# EAGLE design 2030_Switches (EAGLE 7.7.0)
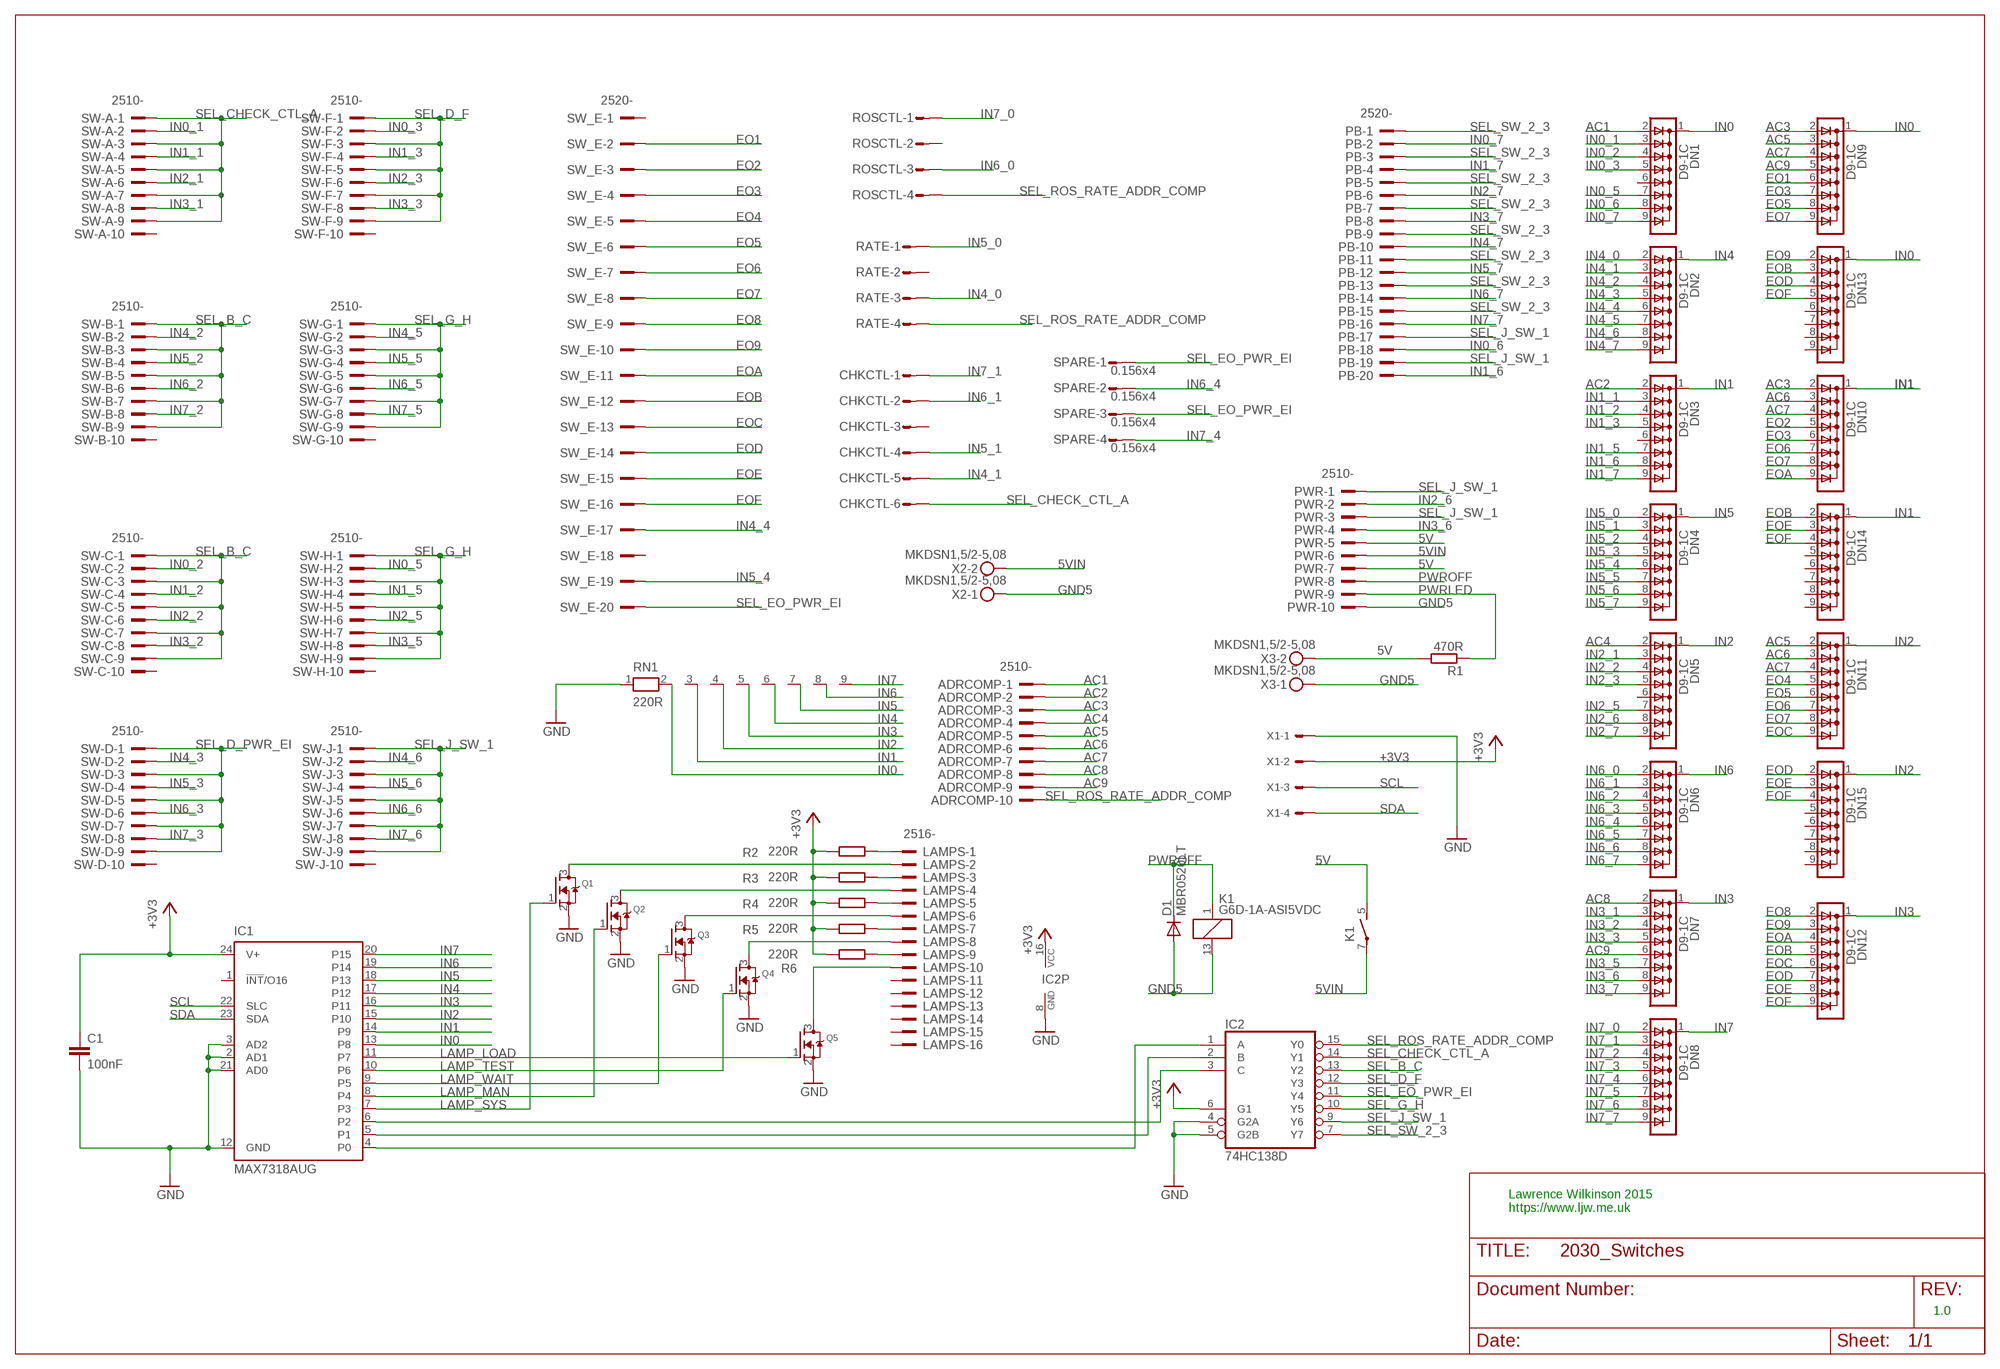
[diagram p0: schematic, sheet 1]

## Parts
ADRCOMP  2510-  [PAK100/2500-10]
C1  100nF  C-EUC1206  [C1206]
CHKCTL  S06P  [S06P]
D1  MBR0520LT  [SOD123]
DN1  D9-1C  [SIL09C]
DN2  D9-1C  [SIL09C]
DN3  D9-1C  [SIL09C]
DN4  D9-1C  [SIL09C]
DN5  D9-1C  [SIL09C]
DN6  D9-1C  [SIL09C]
DN7  D9-1C  [SIL09C]
DN8  D9-1C  [SIL09C]
DN9  D9-1C  [SIL09C]
DN10  D9-1C  [SIL09C]
DN11  D9-1C  [SIL09C]
DN12  D9-1C  [SIL09C]
DN13  D9-1C  [SIL09C]
DN14  D9-1C  [SIL09C]
DN15  D9-1C  [SIL09C]
IC1  MAX7318AUG  MAX7313AEGSOIC  [SO24L]
IC2  74HC138D  [SO16]
K1  G6D-1A-ASI5VDC  [G6D]
LAMPS  2516-  [PAK100/2500-16]
PB  2520-  [PAK100/2500-20]
PWR  2510-  [PAK100/2500-10]
Q1  MOSFET-NREFLOW  [SOT23]
Q2  MOSFET-NREFLOW  [SOT23]
Q3  MOSFET-NREFLOW  [SOT23]
Q4  MOSFET-NREFLOW  [SOT23]
Q5  MOSFET-NREFLOW  [SOT23]
R1  470R  R-EU_M1206  [M1206]
R2  220R  R-EU_R0805  [R0805]
R3  220R  R-EU_R0805  [R0805]
R4  220R  R-EU_R0805  [R0805]
R5  220R  R-EU_R0805  [R0805]
R6  220R  R-EU_R0805  [R0805]
RATE  S04P  [S04P]
RN1  220R  RN08  [RN-9]
ROSCTL  S04P  [S04P]
SPARE  0.156x4  S04P  [S04P]
SW-A  2510-  [PAK100/2500-10]
SW-B  2510-  [PAK100/2500-10]
SW-C  2510-  [PAK100/2500-10]
SW-D  2510-  [PAK100/2500-10]
SW-F  2510-  [PAK100/2500-10]
SW-G  2510-  [PAK100/2500-10]
SW-H  2510-  [PAK100/2500-10]
SW-J  2510-  [PAK100/2500-10]
SW_E  2520-  [PAK100/2500-20]
X1  KK-156-4  [KK-156-4]
X2  MKDSN1,5/2-5,08  [MKDSN1,5/2-5,08]
X3  MKDSN1,5/2-5,08  [MKDSN1,5/2-5,08]

## Nets
5V [power]: K1.5(2:S) PWR.5 PWR.7 R1.2 X3.2
5VIN [power]: K1.7(2:P) PWR.6 X2.2
+3V3 [lowpower]: C1.1 IC1.24(V+) IC2.6(G1) IC2.16(VCC) R2.1 R3.1 R4.1 R5.1 R6.1 X1.2
AC1: ADRCOMP.1 DN1.2
AC2: ADRCOMP.2 DN3.2
AC3: ADRCOMP.3 DN9.2 DN10.2
AC4: ADRCOMP.4 DN5.2
AC5: ADRCOMP.5 DN9.3 DN11.2
AC6: ADRCOMP.6 DN10.3 DN11.3
AC7: ADRCOMP.7 DN9.4 DN10.4 DN11.4
AC8: ADRCOMP.8 DN7.2
AC9: ADRCOMP.9 DN7.6 DN9.5
EO1: DN9.6 SW_E.2
EO2: DN10.5 SW_E.3
EO3: DN9.7 DN10.6 SW_E.4
EO4: DN11.5 SW_E.5
EO5: DN9.8 DN11.6 SW_E.6
EO6: DN10.7 DN11.7 SW_E.7
EO7: DN9.9 DN10.8 DN11.8 SW_E.8
EO8: DN12.2 SW_E.9
EO9: DN12.3 DN13.2 SW_E.10
EOA: DN10.9 DN12.4 SW_E.11
EOB: DN12.5 DN13.3 DN14.2 SW_E.12
EOC: DN11.9 DN12.6 SW_E.13
EOD: DN12.7 DN13.4 DN15.2 SW_E.14
EOE: DN12.8 DN14.3 DN15.3 SW_E.15
EOF: DN12.9 DN13.5 DN14.4 DN15.4 SW_E.16
GND [lowpower]: C1.2 IC1.2(AD1) IC1.3(AD2) IC1.12(GND) IC1.21(AD0) IC2.4(G2A) IC2.5(G2B) IC2.8(GND) Q1.2(S) Q2.2(S) Q3.2(S) Q4.2(S) Q5.2(S) RN1.1 X1.1
GND5 [power]: D1.A K1.13 PWR.10 X2.1 X3.1
IN0: DN1.1(C) DN9.1(C) DN13.1(C) IC1.13(P8) RN1.2
IN0_1: DN1.3 SW-A.2
IN0_2: DN1.4 SW-C.2
IN0_3: DN1.5 SW-F.2
IN0_5: DN1.7 SW-H.2
IN0_6: DN1.8 PB.18
IN0_7: DN1.9 PB.2
IN1: DN3.1(C) DN10.1(C) DN14.1(C) IC1.14(P9) RN1.3
IN1_1: DN3.3 SW-A.4
IN1_2: DN3.4 SW-C.4
IN1_3: DN3.5 SW-F.4
IN1_5: DN3.7 SW-H.4
IN1_6: DN3.8 PB.20
IN1_7: DN3.9 PB.4
IN2: DN5.1(C) DN11.1(C) DN15.1(C) IC1.15(P10) RN1.4
IN2_1: DN5.3 SW-A.6
IN2_2: DN5.4 SW-C.6
IN2_3: DN5.5 SW-F.6
IN2_5: DN5.7 SW-H.6
IN2_6: DN5.8 PWR.2
IN2_7: DN5.9 PB.6
IN3: DN7.1(C) DN12.1(C) IC1.16(P11) RN1.5
IN3_1: DN7.3 SW-A.8
IN3_2: DN7.4 SW-C.8
IN3_3: DN7.5 SW-F.8
IN3_5: DN7.7 SW-H.8
IN3_6: DN7.8 PWR.4
IN3_7: DN7.9 PB.8
IN4: DN2.1(C) IC1.17(P12) RN1.6
IN4_0: DN2.2 RATE.3
IN4_1: CHKCTL.5 DN2.3
IN4_2: DN2.4 SW-B.2
IN4_3: DN2.5 SW-D.2
IN4_4: DN2.6 SW_E.17
IN4_5: DN2.7 SW-G.2
IN4_6: DN2.8 SW-J.2
IN4_7: DN2.9 PB.10
IN5: DN4.1(C) IC1.18(P13) RN1.7
IN5_0: DN4.2 RATE.1
IN5_1: CHKCTL.4 DN4.3
IN5_2: DN4.4 SW-B.4
IN5_3: DN4.5 SW-D.4
IN5_4: DN4.6 SW_E.19
IN5_5: DN4.7 SW-G.4
IN5_6: DN4.8 SW-J.4
IN5_7: DN4.9 PB.12
IN6: DN6.1(C) IC1.19(P14) RN1.8
IN6_0: DN6.2 ROSCTL.3
IN6_1: CHKCTL.2 DN6.3
IN6_2: DN6.4 SW-B.6
IN6_3: DN6.5 SW-D.6
IN6_4: DN6.6 SPARE.2
IN6_5: DN6.7 SW-G.6
IN6_6: DN6.8 SW-J.6
IN6_7: DN6.9 PB.14
IN7: DN8.1(C) IC1.20(P15) RN1.9
IN7_0: DN8.2 ROSCTL.1
IN7_1: CHKCTL.1 DN8.3
IN7_2: DN8.4 SW-B.8
IN7_3: DN8.5 SW-D.8
IN7_4: DN8.6 SPARE.4
IN7_5: DN8.7 SW-G.8
IN7_6: DN8.8 SW-J.8
IN7_7: DN8.9 PB.16
LAMP_LOAD: IC1.11(P7) Q5.1(G)
LAMP_MAN: IC1.8(P4) Q2.1(G)
LAMP_SYS: IC1.7(P3) Q1.1(G)
LAMP_TEST: IC1.10(P6) Q4.1(G)
LAMP_WAIT: IC1.9(P5) Q3.1(G)
N$1: LAMPS.1 R2.2
N$2: LAMPS.3 R3.2
N$3: LAMPS.5 R4.2
N$4: LAMPS.7 R5.2
N$5: LAMPS.9 R6.2
N$7: LAMPS.10 Q5.3(D)
N$8: LAMPS.8 Q4.3(D)
N$9: LAMPS.6 Q3.3(D)
N$10: LAMPS.4 Q2.3(D)
N$11: LAMPS.2 Q1.3(D)
PWRLED: PWR.9 R1.1
PWROFF: D1.C K1.1 PWR.8
SCAN_0: IC1.4(P0) IC2.1(A)
SCAN_1: IC1.5(P1) IC2.2(B)
SCAN_2: IC1.6(P2) IC2.3(C)
SCL: IC1.22(SLC) X1.3
SDA: IC1.23(SDA) X1.4
SEL_B_C: IC2.13(Y2) SW-B.1 SW-B.3 SW-B.5 SW-B.7 SW-B.9 SW-C.1 SW-C.3 SW-C.5 SW-C.7 SW-C.9
SEL_CHECK_CTL_A: CHKCTL.6 IC2.14(Y1) SW-A.1 SW-A.3 SW-A.5 SW-A.7 SW-A.9
SEL_D_F: IC2.12(Y3) SW-F.1 SW-F.3 SW-F.5 SW-F.7 SW-F.9
SEL_D_PWR_EI: SW-D.1 SW-D.3 SW-D.5 SW-D.7 SW-D.9
SEL_EO_PWR_EI: IC2.11(Y4) SPARE.1 SPARE.3 SW_E.20
SEL_G_H: IC2.10(Y5) SW-G.1 SW-G.3 SW-G.5 SW-G.7 SW-G.9 SW-H.1 SW-H.3 SW-H.5 SW-H.7 SW-H.9
SEL_J_SW_1: IC2.9(Y6) PB.17 PB.19 PWR.1 PWR.3 SW-J.1 SW-J.3 SW-J.5 SW-J.7 SW-J.9
SEL_ROS_RATE_ADDR_COMP: ADRCOMP.10 IC2.15(Y0) RATE.4 ROSCTL.4
SEL_SW_2_3: IC2.7(Y7) PB.1 PB.3 PB.5 PB.7 PB.9 PB.11 PB.13 PB.15
Unconnected: CHKCTL.3 DN1.6 DN3.6 DN5.6 DN13.6 DN13.7 DN13.8 DN13.9 DN14.5 DN14.6 DN14.7 DN14.8 DN14.9 DN15.5 DN15.6 DN15.7 DN15.8 DN15.9 IC1.1(!INT!/O16) LAMPS.11 LAMPS.12 LAMPS.13 LAMPS.14 LAMPS.15 LAMPS.16 RATE.2 ROSCTL.2 SW-A.10 SW-B.10 SW-C.10 SW-D.10 SW-F.10 SW-G.10 SW-H.10 SW-J.10 SW_E.1 SW_E.18

## Notes on the sheet
- Lawrence Wilkinson 2015
  https://www.ljw.me.uk
- 1.0

## Library data of the parts
ADRCOMP PWR SW-A SW-B SW-C SW-D SW-F SW-G SW-H SW-J = con-3m:2510-: 3M (TM) Pak 100 4-Wall Header Source: 3M; MF: 3M; MPN: 2510-6002UB; OC_FARNELL: 9838244; OC_NEWARK: 46F4725
C1 = resistor:C-EU: CAPACITOR, European symbol
CHKCTL = con-amp-mt:S06P: AMP MT CONNECTOR; OC_FARNELL: unknown; OC_NEWARK: unknown
D1 = diode:MBR0520LT: SCHOTTKY BARRIER RECTIFIER Source: http://onsemi.com .. MBR0520LT1-D.pdf
DN1-DN15 = diode:D9-1C: 8 DIODES SIL, common cathode
IC1 = maxim:MAX7313AEG: 16-Port I/O Expander with LED Intensity Control, Interrupt, and Hot-Insertion Protection Source: http://datasheets.maxim-ic.com/en/ds/MAX7313.pdf
IC2 = 74xx-eu:74*138: 3-line to 8-line DECODER/DEMULTIPLEXER
K1 = relay:G6D?*: OMRON Slim, Miniature PCB Relay 17.5 × 6.5 × 12.5 mm with Socked Source: http://ecb.omron.com.sg/pdf/relay/power/G6D.pdf; OC_FARNELL: 9812660; OC_NEWARK: unknown
LAMPS = con-3m:2516-: 3M (TM) Pak 100 4-Wall Header Source: 3M; OC_FARNELL: unknown; OC_NEWARK: unknown
PB SW_E = con-3m:2520-: 3M (TM) Pak 100 4-Wall Header Source: 3M; OC_FARNELL: unknown; OC_NEWARK: unknown
Q1-Q5 = adafruit:MOSFET-N: N-Channel Mosfet 2N7002E - 60V 260mA SOT23 [Digikey: 2N7002ET1GOSTR-ND] - REEL BSH103 - 30V 850mA SOT23 [Digikey: 568-5013-1-ND]
R1-R6 = resistor:R-EU_: RESISTOR, European symbol
RATE ROSCTL SPARE = con-amp-mt:S04P: AMP MT CONNECTOR; OC_FARNELL: unknown; OC_NEWARK: unknown
RN1 = resistor-net:RN08: RESISTOR NETWORK; OC_FARNELL: unknown; OC_NEWARK: unknown
X1 = con-molex:KK-156-4: KK 156 HEADER Source: http://www.molex.com/pdm_docs/sd/026604100_sd.pdf; OC_FARNELL: unknown; OC_NEWARK: unknown
X2 X3 = con-phoenix-508:MKDSN1,5/2-5,08: MKDSN 1,5/ 2-5,08 Printklemme Nennstrom: 13,5 A Nennspannung: 250 V Rastermaß: 5,08 mm Polzahl: 2 Anschlussart: Schraubanschluss Montage: Löten Anschlussrichtung Leiter/Platine: 0 ° Artikelnummer: 1729128 Source: http://eshop.phoenixcontact.com .. 1729128.pdf

## Net classes
1 power: width 1.27 mm
2 lowpower: width 0.61 mm

## Board
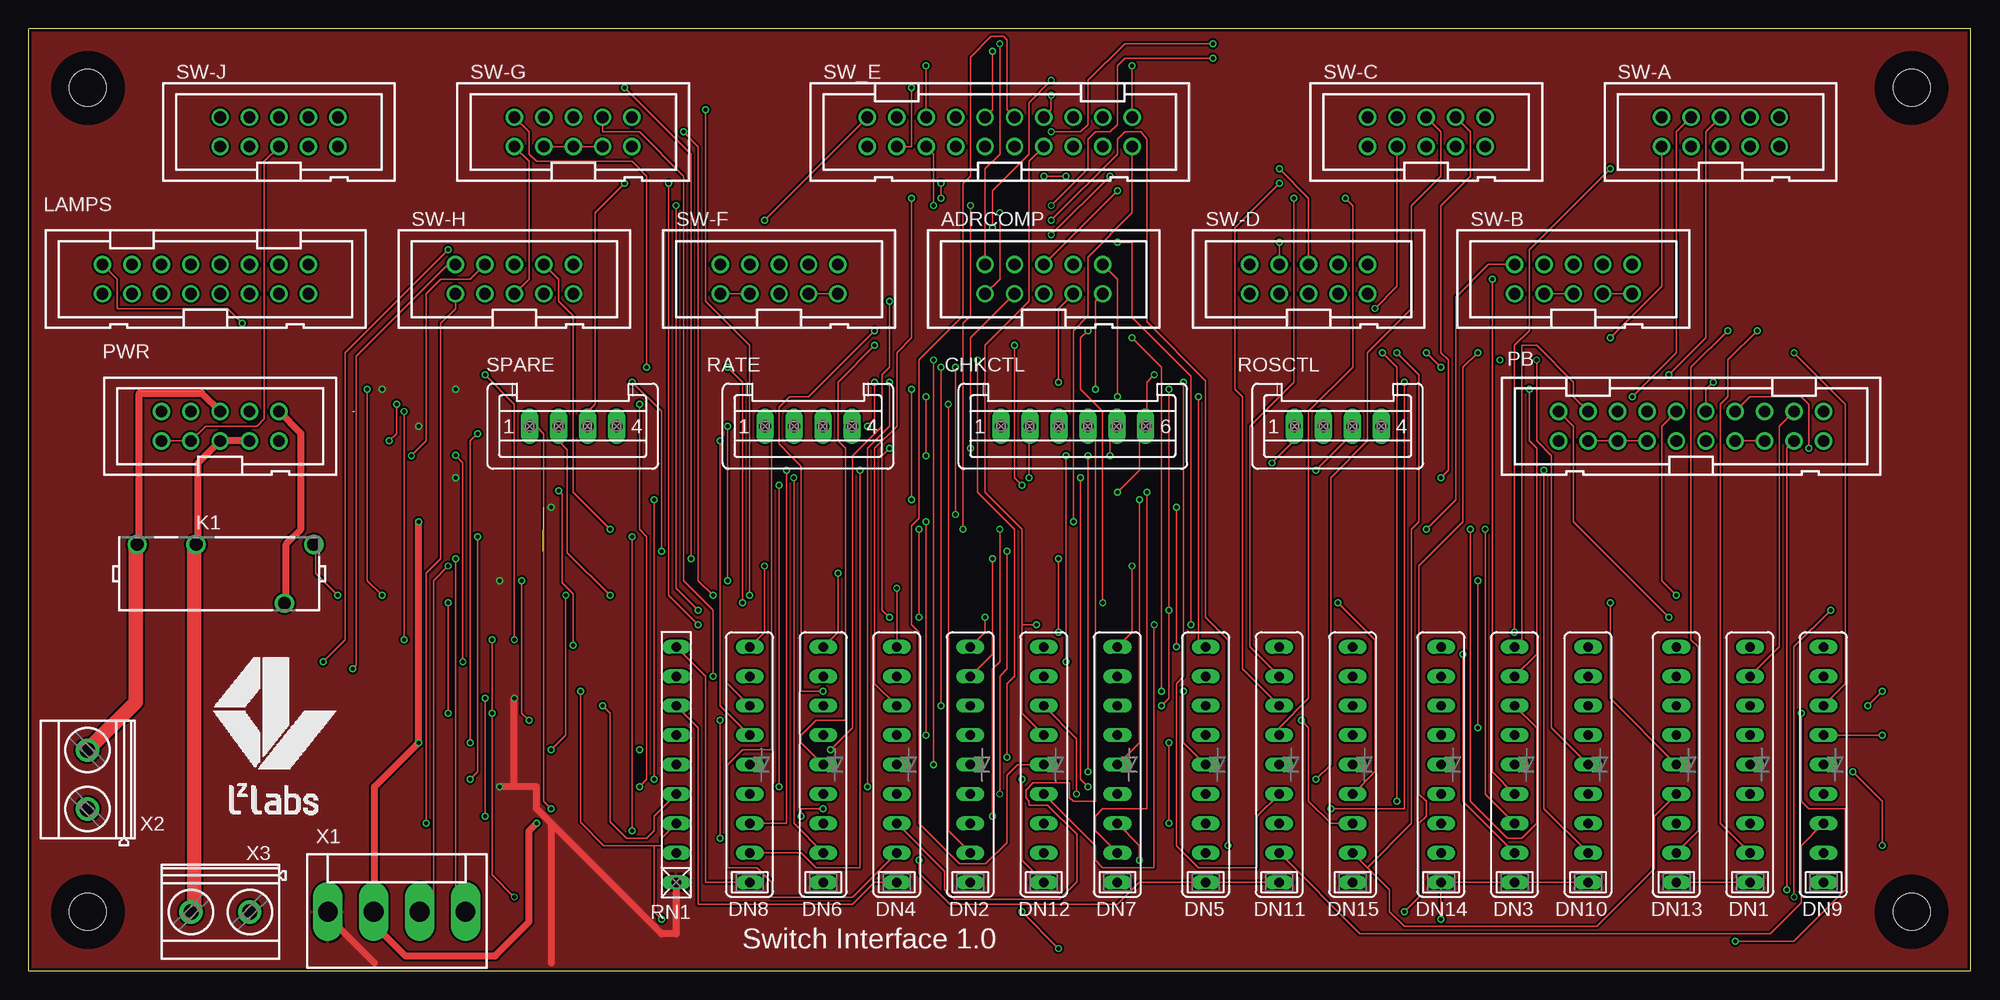
[diagram p1: board, top side]
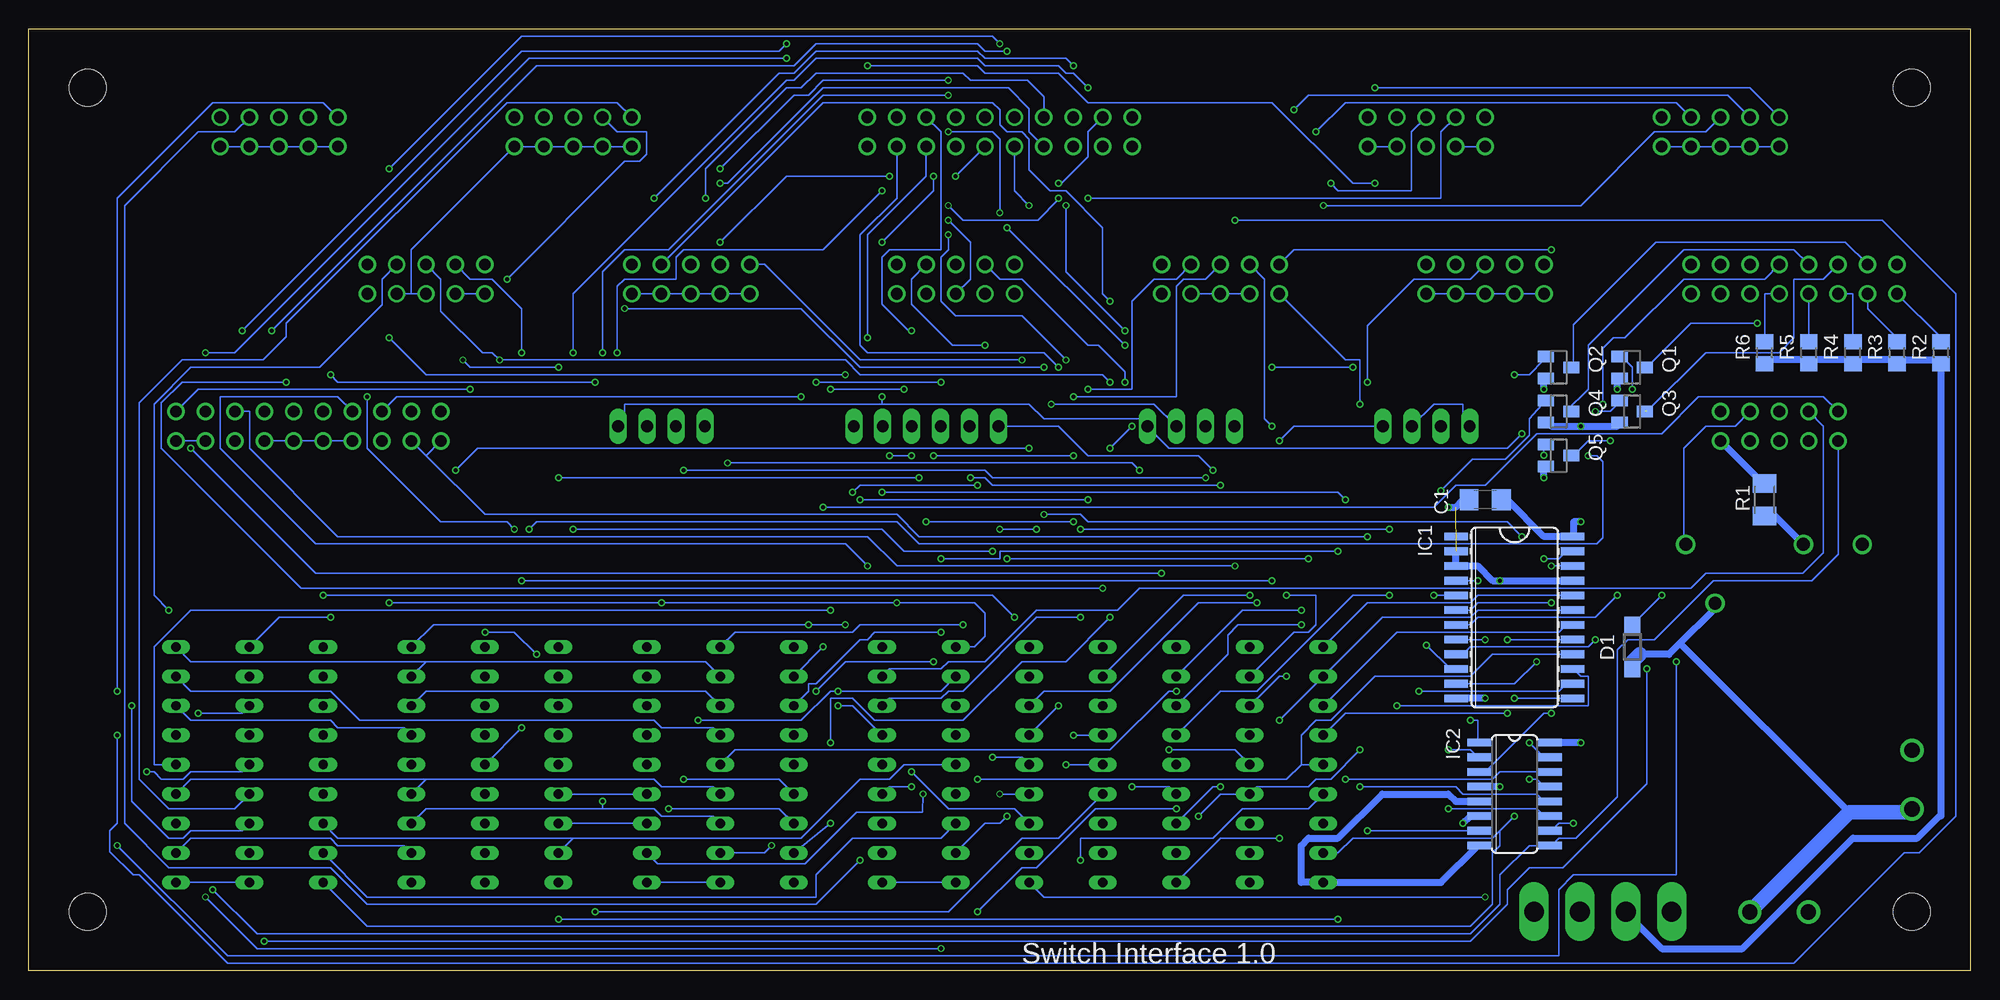
[diagram p2: board, bottom side, seen from below]

Size 167.64 x 81.28 mm. Coordinates in mm from the lower left corner, seen from the top.
Outline: 0,0 167.64,0 167.64,81.28 0,81.28 0,0
Copper layers (1*16): Top 0.018mm / dielectric 1.55mm / Bottom 0.018mm
Design rules "eC_2Layer_PClass6_BaseCopperO18_eCDefault *": minimum track width 0.15mm, minimum drill 0.35mm, track to track 0.17mm, track to pad 0.17mm, pad to pad 0.17mm, via to via 0.17mm, smd to smd 0mil, copper to edge 0.25mm, drill to drill 0.35mm, minimum pad ring 0.175mm, minimum via ring 0.125mm, stop-mask expansion 0mil, vias tented up to drill 0.45mm, thermal gap 0.2mm
Holes 3.17 mm at 5.08,76.2 5.08,5.08 162.56,5.08 162.56,76.2
tRestrict: area 3.5,74.6 to 6.7,77.8; area 3.5,3.5 to 6.7,6.7; area 161,3.5 to 164.1,6.7; area 161,74.6 to 164.1,77.8
bRestrict: area 3.5,74.6 to 6.7,77.8; area 3.5,3.5 to 6.7,6.7; area 161,74.6 to 164.1,77.8; area 161,3.5 to 164.1,6.7

### Footprints (pad centres in the part's own frame; a part is rotated, then mirrored left to right if it is on the bottom)
PAK100/2500-10 = drill 1 pad 1.422: 1 -5.08,-1.27; 2 -5.08,1.27; 3 -2.54,-1.27; 4 -2.54,1.27; 5 0,-1.27; 6 0,1.27; 7 2.54,-1.27; 8 2.54,1.27; 9 5.08,-1.27; 10 5.08,1.27
C1206 = smd 1.6 x 1.8: 1 -1.4,0; 2 1.4,0
S06P = drill 1.016 long: 1 6.25,0; 2 3.75,0; 3 1.25,0; 4 -1.25,0; 5 -3.75,0; 6 -6.25,0
SOD123 = smd 1.4 x 1.4: A 1.9,0; C -1.9,0
SIL09C = drill 0.813 long: 1 -10.16,0; 2 -7.62,0; 3 -5.08,0; 4 -2.54,0; 5 0,0; 6 2.54,0; 7 5.08,0; 8 7.62,0; 9 10.16,0
SO24L = smd 0.66 x 2.032: 1 -6.985,-5.029; 2 -5.715,-5.029; 3 -4.445,-5.029; 4 -3.175,-5.029; 5 -1.905,-5.029; 6 -0.635,-5.029; 7 0.635,-5.029; 8 1.905,-5.029; 9 3.175,-5.029; 10 4.445,-5.029; 11 5.715,-5.029; 12 6.985,-5.029; 13 6.985,5.029; 14 5.715,5.029; 15 4.445,5.029; 16 3.175,5.029; 17 1.905,5.029; 18 0.635,5.029; 19 -0.635,5.029; 20 -1.905,5.029; 21 -3.175,5.029; 22 -4.445,5.029; 23 -5.715,5.029; 24 -6.985,5.029
SO16 = smd 0.66 x 2.032: 1 -4.445,-3.073; 2 -3.175,-3.073; 3 -1.905,-3.073; 4 -0.635,-3.073; 5 0.635,-3.073; 6 1.905,-3.073; 7 3.175,-3.073; 8 4.445,-3.073; 9 4.445,3.073; 10 3.175,3.073; 11 1.905,3.073; 12 0.635,3.073; 13 -0.635,3.073; 14 -1.905,3.073; 15 -3.175,3.073; 16 -4.445,3.073
G6D = drill 1.1 pad 1.676: 1 8.08,2.5; 5 -2.08,2.5; 7 -7.16,2.5; 13 5.54,-2.58
PAK100/2500-16 = drill 1 pad 1.422: 1 -8.89,-1.27; 2 -8.89,1.27; 3 -6.35,-1.27; 4 -6.35,1.27; 5 -3.81,-1.27; 6 -3.81,1.27; 7 -1.27,-1.27; 8 -1.27,1.27; 9 1.27,-1.27; 10 1.27,1.27; 11 3.81,-1.27; 12 3.81,1.27; 13 6.35,-1.27; 14 6.35,1.27; 15 8.89,-1.27; 16 8.89,1.27
PAK100/2500-20 = drill 1 pad 1.422: 1 -11.43,-1.27; 2 -11.43,1.27; 3 -8.89,-1.27; 4 -8.89,1.27; 5 -6.35,-1.27; 6 -6.35,1.27; 7 -3.81,-1.27; 8 -3.81,1.27; 9 -1.27,-1.27; 10 -1.27,1.27; 11 1.27,-1.27; 12 1.27,1.27; 13 3.81,-1.27; 14 3.81,1.27; 15 6.35,-1.27; 16 6.35,1.27; 17 8.89,-1.27; 18 8.89,1.27; 19 11.43,-1.27; 20 11.43,1.27
SOT23 = smd 1 x 1.4: 1 -0.95,-1.1; 2 0.95,-1.1; 3 0,1.1
M1206 = smd 1.6 x 2: 1 -1.4,0; 2 1.4,0
R0805 = smd 1.3 x 1.5: 1 -0.95,0; 2 0.95,0
S04P = drill 1.016 long: 1 3.75,0; 2 1.25,0; 3 -1.25,0; 4 -3.75,0
RN-9 = drill 0.813 long: 1 -10.16,0; 2 -7.62,0; 3 -5.08,0; 4 -2.54,0; 5 0,0; 6 2.54,0; 7 5.08,0; 8 7.62,0; 9 10.16,0
KK-156-4 = drill 1.7 pad 2.184 long: 1 -5.94,0; 2 -1.98,0; 3 1.98,0; 4 5.94,0
MKDSN1,5/2-5,08 = drill 1.3 pad 2: 1 -2.561,0.025; 2 2.519,0.025

### Placement (x,y rotation side)
ADRCOMP  87.63,59.69 0 top
C1  41.91,40.64 180 bottom
CHKCTL  90.17,46.99 180 top
D1  29.21,27.94 270 bottom
DN1  148.59,17.78 90 top
DN2  81.28,17.78 90 top
DN3  128.27,17.78 90 top
DN4  74.93,17.78 90 top
DN5  101.6,17.78 90 top
DN6  68.58,17.78 90 top
DN7  93.98,17.78 90 top
DN8  62.23,17.78 90 top
DN9  154.94,17.78 90 top
DN10  134.62,17.78 90 top
DN11  107.95,17.78 90 top
DN12  87.63,17.78 90 top
DN13  142.24,17.78 90 top
DN14  121.92,17.78 90 top
DN15  114.3,17.78 90 top
IC1  39.37,30.48 270 bottom
IC2  39.37,15.24 270 bottom
K1  16.51,34.29 0 top
LAMPS  15.24,59.69 0 top
PB  143.51,46.99 0 top
PWR  16.51,46.99 0 top
Q1  29.21,52.07 270 bottom
Q2  35.56,52.07 270 bottom
Q3  29.21,48.26 270 bottom
Q4  35.56,48.26 270 bottom
Q5  35.56,44.45 270 bottom
R1  17.78,40.64 270 bottom
R2  2.54,53.34 90 bottom
R3  6.35,53.34 90 bottom
R4  10.16,53.34 90 bottom
R5  13.97,53.34 90 bottom
R6  17.78,53.34 90 bottom
RATE  67.31,46.99 180 top
RN1  55.88,17.78 90 top
ROSCTL  113.03,46.99 180 top
SPARE  46.99,46.99 180 top
SW-A  146.05,72.39 0 top
SW-B  133.35,59.69 0 top
SW-C  120.65,72.39 0 top
SW-D  110.49,59.69 0 top
SW-F  64.77,59.69 0 top
SW-G  46.99,72.39 0 top
SW-H  41.91,59.69 0 top
SW-J  21.59,72.39 0 top
SW_E  83.82,72.39 0 top
X1  31.75,5.08 0 top
X2  5.08,16.51 90 top
X3  16.51,5.08 180 top

### Tracks (layer width: path | path; a pad name or v marks a point on that pad's centre or on a via)
5V
  Top 0.61: PWR.7 PWR.5 14.61,43.81 14.61,36.83
  Top 1.27: 14.61,36.83 K1.5 14.29,36.2 14.29,5.08 X3.2
  Bottom 0.15: R1.2 16.88,39.24
  Bottom 0.61: K1.5 16.88,39.24
5VIN
  Top 0.61: PWR.6 14.92,49.85 9.53,49.85 9.53,36.83
  Top 1.27: 9.53,36.83 K1.7 9.21,36.2 9.21,23.18 5.08,19.05 X2.2
+3V3  (via drill 0.35)
  Top 0.61: 29.84,5.08 29.84,15.88 v33.66,19.68 v33.66,38.73 | v43.84,12.72 43.18,12.06 43.18,4.2 40.26,1.27 32.49,1.27 29.84,3.91 29.84,5.08 | 29.84,5.08 X1.2
  Bottom 0.61: C1.1 40.01,40.64 36.83,37.47 IC1.24 34.29,37.47 34.29,38.73 v33.66,38.73 | v33.66,19.68 IC2.16 | IC2.6 43.18,13.34 v43.84,12.72 | 2.61,13.4 4.58,11.43 10.16,11.43 19.68,1.91 26.67,1.91 29.84,5.08 X1.2 | 2.61,13.4 2.54,13.47 | 6.35,52.7 2.54,52.7 R2.1 2.54,13.34 2.61,13.4 | 6.35,52.7 10.16,52.7 | 6.35,52.7 R3.1 | 10.16,52.7 13.97,52.7 | 10.16,52.7 R4.1 | 13.97,52.7 17.78,52.7 R6.1 | 13.97,52.7 R5.1
AC1  (via drill 0.35)
  Top 0.15: DN1.2 146.05,12.7 146.05,48.9 146.69,49.53 146.69,52.7 v149.22,55.24 | v83.82,65.41 83.82,59.69 ADRCOMP.1 | v102.23,80.01 94.61,80.01 91.44,76.83 91.44,73.03 90.81,72.39 v88.27,72.39
  Bottom 0.15: v88.27,72.39 84.45,72.39 83.82,71.75 v83.82,65.41 | v102.23,80.01 102.87,79.38 125.09,79.38 v149.22,55.24
AC2  (via drill 0.35)
  Top 0.15: DN3.2 123.83,14.61 v123.83,27.3 | ADRCOMP.2 82.55,69.22 83.82,70.48 v83.82,80.01 | v136.53,69.22 129.54,62.23 129.54,55.24 128.27,53.98 v128.27,29.21
  Bottom 0.15: v83.82,80.01 84.45,80.64 125.09,80.64 v136.53,69.22 | v128.27,29.21 125.73,29.21 v123.83,27.3
AC3  (via drill 0.35)
  Top 0.15: v130.81,43.18 130.81,13.97 DN10.2 | ADRCOMP.3 81.28,54.61 v81.28,45.09
  Bottom 0.15: DN10.2 135.25,10.79 140.97,10.79 141.6,11.43 153.67,11.43 DN9.2 | v81.28,45.09 128.91,45.09 v130.81,43.18
AC4  (via drill 0.35)
  Top 0.15: v98.42,19.68 v98.42,12.7 | v74.3,30.48 73.66,31.11 73.66,44.45 v74.3,45.09 | v72.39,46.99 73.03,47.62 v73.03,50.8
  Bottom 0.15: v98.42,12.7 DN5.2 | v98.42,19.68 98.42,23.5 96.52,23.5 94.61,21.59 87,21.59 81.92,26.67 78.11,26.67 v74.3,30.48 | v72.39,46.99 v74.3,45.09 | v73.03,50.8 73.03,51.69 75.31,53.98 76.2,53.98 81.92,59.69 83.82,59.69 ADRCOMP.4
AC5  (via drill 0.35)
  Top 0.15: DN11.2 114.94,3.17 150.34,3.17 153.03,5.87 153.03,10.79 DN9.3 | v88.27,64.77 93.98,70.48 93.98,71.75 94.61,72.39 96,72.39 96.52,71.75 96.52,56 101.6,50.92 101.6,30.48 103.5,28.57 v103.5,10.79
  Bottom 0.15: v103.5,10.79 104.14,10.16 DN11.2 | ADRCOMP.5 86.36,59.69 86.36,62.87 v88.27,64.77
AC6  (via drill 0.35)
  Top 0.15: ADRCOMP.6 88.9,62.23 v93.98,67.31 | v116.84,53.34 118.11,52.07 v118.11,14.61
  Bottom 0.15: DN11.3 108.58,13.34 113.03,13.34 113.67,13.97 118.11,13.97 | 118.11,13.97 133.35,13.97 DN10.3 | v93.98,67.31 99.06,62.23 111.12,62.23 111.76,61.59 111.76,59.69 116.2,59.69 116.84,59.05 v116.84,53.34 | 118.11,13.97 v118.11,14.61
AC7  (via drill 0.35)
  Top 0.15: v99.69,50.8 99.69,25.4 99.06,24.77 99.06,10.79 100.97,8.89 106.05,8.89 106.05,13.34 DN11.4 | ADRCOMP.7 88.9,57.15 v88.9,50.8
  Bottom 0.15: DN11.4 108.58,15.88 113.03,15.88 113.67,16.51 133.35,16.51 | DN10.4 133.35,16.51 | DN9.4 153.67,16.51 133.35,16.51 | v99.69,50.8 v88.9,50.8
AC8  (via drill 0.35)
  Top 0.15: DN7.2 92.08,12.06 92.08,13.34 92.71,13.97 96.52,13.97 v96.52,41.27 | v85.72,41.91 85.09,42.55 v85.09,53.98
  Bottom 0.15: v96.52,41.27 95.89,41.91 v85.72,41.91 | ADRCOMP.8 91.44,59.69 91.44,57.53 87.88,53.98 v85.09,53.98
AC9  (via drill 0.35)
  Top 0.15: v97.79,22.86 98.42,23.5 v98.42,31.11 v98.42,50.16 | ADRCOMP.9 92.08,57.78 v92.08,50.16
  Bottom 0.15: DN7.6 96.52,22.86 v97.79,22.86 | v98.42,31.11 153.67,31.11 156.84,27.94 156.84,17.78 DN9.5 | v98.42,50.16 v92.08,50.16
EO1  (via drill 0.35)
  Top 0.15: v160.02,20.32 DN9.6 | SW_E.2 v63.5,64.77
  Bottom 0.15: v160.02,20.32 160.02,12.7 160.66,12.06 160.66,10.26 158.65,8.26 158.12,8.26 150.5,0.64 15.24,0.64 5.71,10.16 4.45,10.16 1.27,13.34 1.27,58.42 7.62,64.77 v63.5,64.77
EO2  (via drill 0.35)
  Top 0.15: DN10.5 131.44,20.95 131.44,44.45 130.18,45.72 v130.18,52.7 | SW_E.3 76.2,71.12 v76.2,76.2 | v121.92,52.07 v120.65,53.34
  Bottom 0.15: v76.2,76.2 77.47,77.47 78.11,77.47 78.74,78.11 85.09,78.11 85.72,78.74 99.69,78.74 101.6,76.83 102.23,76.83 120.65,58.42 v120.65,53.34 | v121.92,52.07 129.54,52.07 v130.18,52.7
EO3  (via drill 0.35)
  Top 0.15: DN9.7 156.84,24.77 156.84,48.9 v152.4,53.34 | v78.74,66.67 v78.74,67.94 | v88.27,66.04 91.44,69.22 91.44,71.75 92.08,72.39 93.34,72.39 93.98,73.03 93.98,78.11 94.61,78.74 v102.23,78.74
  Bottom 0.15: DN10.6 135.25,20.95 140.97,20.95 141.6,21.59 153.67,21.59 DN9.7 | SW_E.4 76.2,72.39 76.2,70.23 78.49,67.94 v78.74,67.94 | v88.27,66.04 87,64.77 80.54,64.77 78.74,66.57 v78.74,66.67 | v102.23,78.74 124.46,78.74 149.86,53.34 v152.4,53.34
EO4  (via drill 0.35)
  Top 0.15: v68.58,24.13 66.67,24.13 66.67,43.55 65.78,44.45 64.77,45.46 64.77,48.63 65.67,49.53 67.31,49.53 v73.03,55.24 | SW_E.5 78.11,70.48 v78.11,66.04
  Bottom 0.15: DN11.5 106.68,19.05 74.3,19.05 69.22,24.13 v68.58,24.13 | v78.11,66.04 78.11,60.33 v73.03,55.24
EO5  (via drill 0.35)
  Top 0.15: DN11.6 107.95,20.95 110.49,23.5 110.49,48.26 114.3,52.07 114.3,66.04 v113.67,66.67 | v77.47,78.11 SW_E.6
  Bottom 0.15: DN11.6 108.58,20.95 113.03,20.95 113.67,21.59 139.06,21.59 141.6,24.13 153.67,24.13 DN9.8 | v77.47,78.11 78.11,78.74 85.09,78.74 85.72,79.38 99.69,79.38 101.6,77.47 102.87,77.47 v113.67,66.67
EO6  (via drill 0.35)
  Top 0.15: DN11.7 104.78,26.04 104.78,49.53 104.14,50.16 104.14,64.14 v107.95,67.94
  Bottom 0.15: DN11.7 109.22,24.13 133.35,24.13 DN10.7 | SW_E.7 81.28,72.39 81.28,74.4 83.08,76.2 99.06,76.2 107.31,67.94 v107.95,67.94
EO7  (via drill 0.35)
  Top 0.15: DN11.8 105.41,27.94 105.41,46.99 109.22,50.8 v109.22,66.67
  Bottom 0.15: DN11.8 109.22,26.67 133.35,26.67 | DN10.8 133.35,26.67 | DN9.9 153.67,26.67 133.35,26.67 | SW_E.8 80.01,75.42 81.43,76.83 86.36,76.83 87,77.47 99.69,77.47 100.97,76.2 102.23,76.2 109.22,69.22 v109.22,66.67
EO8  (via drill 0.35)
  Top 0.15: v81.28,66.04 81.28,56.52 80.64,55.88 v80.64,38.1 | v83.19,13.34 83.19,26.04 83.82,26.67 v83.82,38.1
  Bottom 0.15: DN12.2 85.09,12.7 83.82,12.7 v83.19,13.34 | v80.64,38.1 v83.82,38.1 | v81.28,66.04 82.55,67.31 SW_E.9
EO9  (via drill 0.35)
  Top 0.15: DN13.2 144.15,12.06 144.15,27.94 143.51,28.57 143.51,52.07 v146.69,55.24 | SW_E.10 83.19,74.3 v83.19,79.38
  Bottom 0.15: DN12.3 88.9,11.43 96.52,11.43 99.69,8.26 99.69,6.35 138.43,6.35 DN13.2 | v83.19,79.38 85.09,79.38 85.72,80.01 99.69,80.01 101.6,78.11 123.83,78.11 v146.69,55.24
EOA  (via drill 0.35)
  Top 0.15: DN12.4 92.08,10.79 92.08,9.53 92.71,8.89 97.16,8.89 v97.16,29.84 | v100.33,29.84 100.33,51.3 95.75,55.88 95.25,56.38 95.25,62.87 v93.98,62.87 | v89.53,68.58 v87.63,68.58
  Bottom 0.15: v97.16,29.84 v100.33,29.84 132.72,29.84 DN10.9 | v87.63,68.58 SW_E.11 | v93.98,62.87 89.53,67.31 v89.53,68.58
EOB
  Top 0.15: SW_E.12 84.45,74.3 84.45,80.33 84.14,80.64 83.08,80.64 81.28,78.85 81.28,68.58 80.64,67.94 80.64,56.52 76.83,52.7 76.83,39.05 76.2,38.42 76.2,29.84 76.83,29.21 76.83,12.7 80.33,9.21 82.61,9.21 84.45,11.05 84.45,16.88 85.35,17.78 DN12.5
  Bottom 0.15: DN12.5 92.08,17.78 93.34,16.51 95.89,16.51 100.97,11.43 120.65,11.43 | DN14.2 120.65,11.43 | DN13.3 140.97,11.43 120.65,11.43
EOC  (via drill 0.35)
  Top 0.15: DN12.6 85.72,22.23 85.72,29.84 | 85.72,29.84 85.72,38.1 82.55,41.27 82.55,53.98 86.36,57.78 86.36,69.85 SW_E.13 | v87,29.84 85.72,29.84
  Bottom 0.15: DN11.9 106.68,29.21 96.52,29.21 95.89,29.84 v87,29.84
EOD  (via drill 0.35)
  Top 0.15: 115.57,8.89 117.47,6.99 117.47,5.08 118.75,3.81 135.38,3.81 140.34,8.77 140.34,13.34 DN13.4 | 115.57,8.89 DN15.2 | SW_E.14 88.27,74.3 v88.27,75.56 | v118.11,53.34 120.02,51.44 120.02,38.73 119.38,38.1 119.38,12.7 115.57,8.89 | DN12.7 90.46,20 v90.46,15.24
  Bottom 0.15: v88.27,75.56 99.06,75.56 112.39,62.23 116.2,62.23 118.11,60.33 v118.11,53.34 | v90.46,15.24 90.49,13.65 96.2,13.65 100.65,9.21 113.35,9.21 DN15.2
EOE  (via drill 0.35)
  Top 0.15: v109.86,21.59 110.49,20.95 110.49,14.61 112.39,12.7 DN15.3 | v97.79,24.13 97.79,52.07 v95.25,54.61
  Bottom 0.15: DN14.3 DN15.3 | DN12.8 88.9,24.13 v97.79,24.13 98.42,24.13 100.97,21.59 v109.86,21.59 | SW_E.15 90.17,68.58 95.25,63.5 v95.25,54.61
EOF  (via drill 0.35)
  Top 0.15: v113.03,31.75 116.2,28.57 116.2,17.14 DN15.4 | DN13.5 136.53,23.5 v136.53,31.75 | v92.71,31.75 92.71,48.26 90.81,50.16 90.81,54.61 v91.44,55.24
  Bottom 0.15: DN12.9 85.99,27.94 85.09,28.84 85.09,30.85 85.99,31.75 v92.71,31.75 v113.03,31.75 v136.53,31.75 | DN15.4 DN14.4 | SW_E.16 88.9,72.39 88.9,62.23 93.34,62.23 93.98,61.59 93.98,57.53 91.69,55.24 v91.44,55.24
GND  (via drill 0.35)  (1 unrouted)
  Top 0.61: 41.91,15.88 43.81,15.88 43.81,13.97 45.09,12.7 | 41.91,15.88 v40.64,15.88 | 45.09,12.7 54.61,3.17 55.88,3.17 RN1.1 | 41.91,15.88 v41.91,23.5 | 29.84,0.64 26.04,4.45 X1.1 | 45.09,12.7 45.09,0.64
  Bottom 0.61: IC1.21 v40.64,33.66 41.27,33.66 42.55,34.92 IC1.3 44.45,34.92 44.45,36.2 IC1.2 | 43.18,40.64 C1.2 43.81,40.64 44.45,40.01 v45.09,40.01 | IC2.8 42.55,10.79 45.72,7.62 RN1.1 57.78,7.62 57.78,10.79 57.15,11.43 54.61,11.43 50.8,15.24 45.09,15.24 44.45,14.61 IC2.5 | v40.64,15.88 IC2.4 | v41.91,23.5 IC1.12 | Q3.2 30.48,46.99 v33.66,46.99 36.2,46.99 Q4.2 | v36.83,42.55 36.83,43.18 Q5.2 | v30.48,50.19 30.48,50.8 Q1.2 | v36.83,50.19 36.83,50.8 Q2.2
  cutout Bottom: 0,81.28 167.64,81.28 167.64,0 0,0
  pour Top: 0,81.28 167.64,81.28 167.64,0 0,0
GND5
  Top 0.61: PWR.10 23.5,46.35 23.5,38.1 22.23,36.83 22.23,31.75 K1.13
  Bottom 0.61: 28.57,27.3 26.04,27.3 25.08,28.26 | 25.08,28.26 22.23,31.11 K1.13 | 25.08,28.26 10.48,13.65
  Bottom 1.27: X3.1 19.05,5.08 10.48,13.65 5.08,13.65 X2.1 | 28.57,27.3 29.21,26.67 D1.A
IN0  (via drill 0.35)
  Top 0.15: DN1.1 DN13.1 | v39.37,13.34 v39.37,23.5
  Bottom 0.15: DN1.1 DN9.1 | v39.37,23.5 IC1.13 | 40.64,12.06 41.27,11.43 53.34,11.43 54.61,10.16 RN1.2 | 40.64,12.06 v39.37,13.34 | DN13.1 138.43,3.81 43.18,3.81 41.27,5.71 41.27,10.16 40.64,10.79 40.64,12.06
IN0_1  (via drill 0.35)
  Top 0.15: v158.75,22.86 v160.02,24.13
  Bottom 0.15: DN1.3 149.22,12.06 153.67,12.06 154.31,11.43 155.57,11.43 158.75,14.61 v158.75,22.86 | SW-A.2 142.24,74.93 151.76,74.93 160.02,66.67 v160.02,24.13
IN0_2
  Bottom 0.15: DN1.4 149.86,13.97 155.57,13.97 158.12,16.51 158.12,49 154.41,52.7 147.42,52.7 145.41,54.71 145.41,55.88 126.36,74.93 116.84,74.93 SW-C.2
IN0_3  (via drill 0.35)
  Top 0.15: v36.2,62.23 27.3,53.34 27.3,28.57 v25.4,26.67 | v160.02,10.79 160.02,14.61 v157.48,17.14
  Bottom 0.15: DN1.5 149.22,17.14 153.67,17.14 154.31,16.51 156.21,16.51 156.84,17.14 v157.48,17.14 | SW-F.2 58.42,62.23 v36.2,62.23 | v25.4,26.67 25.4,8.26 34.29,8.26 35.56,6.99 35.56,1.27 150.5,1.27 v160.02,10.79
IN0_5  (via drill 0.35)
  Top 0.15: v153.03,22.23 153.03,14.61 153.67,13.97 156.84,13.97 156.84,6.99 152.4,2.54 v147.32,2.54 | v27.94,26.04 28.27,26.36 28.27,53.03 36.2,60.96 SW-H.2
  Bottom 0.15: DN1.7 149.22,22.23 v153.03,22.23 | v147.32,2.54 43.18,2.54 40.01,5.71 40.01,6.99 38.1,8.89 35.18,8.89 27.94,16.13 v27.94,26.04
IN0_6
  Top 0.15: DN1.8 151.13,27.94 151.13,46.99 PB.18
IN0_7  (via drill 0.35)
  Top 0.15: v141.6,30.48 133.35,38.73 133.35,46.99 PB.2
  Bottom 0.15: DN1.9 146.05,30.48 v141.6,30.48
IN1  (via drill 0.35)
  Top 0.15: DN10.1 DN3.1 DN14.1 v121.92,4.45 | 53.98,10.79 49.63,10.79 47.62,12.8 v47.62,24.13 | 53.98,10.79 54.61,10.79 54.61,11.43 RN1.3 | v54.61,4.45 53.98,5.08 53.98,10.79
  Bottom 0.15: v47.62,24.13 35.56,24.13 34.92,24.77 IC1.14 | v54.61,4.45 v121.92,4.45
IN1_1  (via drill 0.35)
  Top 0.15: DN3.3 125.73,15.24 v125.73,38.1 | v138.43,49.53 142.24,53.34 142.24,72.39 SW-A.4
  Bottom 0.15: v125.73,38.1 126.36,38.73 132.08,38.73 138.43,45.09 v138.43,49.53
IN1_2  (via drill 0.35)
  Top 0.15: DN3.4 126.36,17.14 v126.36,59.69
  Bottom 0.15: v126.36,59.69 116.2,69.85 114.94,69.85 114.3,70.48 114.3,72.39 116.84,72.39 SW-C.4
IN1_3  (via drill 0.35)
  Top 0.15: v125.09,33.66 v125.09,20.95 | v60.33,33.66 v60.33,46.99
  Bottom 0.15: v125.09,20.95 DN3.5 | v60.33,33.66 v125.09,33.66 | SW-F.4 60.96,59.69 60.96,47.62 v60.33,46.99
IN1_5  (via drill 0.35)
  Top 0.15: DN3.7 130.18,20.95 130.18,12.7 128.91,11.43 127.64,11.43 124.46,14.61 v124.46,38.1 | SW-H.4 38.1,59.69 35.56,59.69 34.29,58.42 34.29,45.72 v33.02,44.45
  Bottom 0.15: v124.46,38.1 123.83,38.73 92.71,38.73 90.81,36.83 32.28,36.83 31.75,37.36 31.75,43.92 32.28,44.45 v33.02,44.45
IN1_6  (via drill 0.35)
  Top 0.15: DN3.8 130.18,27.3 130.18,45.09 129.54,45.72 v129.54,50.16
  Bottom 0.15: v129.54,50.16 153.03,50.16 PB.20
IN1_7
  Top 0.15: DN3.9 128.91,28.57 128.91,53.98 130.18,53.98 133.35,50.8 133.35,49.53 PB.4
IN2  (via drill 0.35)
  Top 0.15: DN11.1 DN5.1 95.89,7.62 93.98,5.71 79.53,5.71 76.83,8.41 v76.83,9.53 | v49.53,22.86 50.16,22.23 50.16,12.85 51.59,11.43 53.34,11.43 53.98,12.06 53.98,13.34 RN1.4
  Bottom 0.15: DN11.1 DN15.1 | v49.53,22.86 33.02,22.86 33.02,25.4 33.66,25.4 34.29,26.04 IC1.15 | v76.83,9.53 76.83,11.43 65.41,11.43 62.87,13.97 57.15,13.97 RN1.4
IN2_1  (via drill 0.35)
  Top 0.15: v112.39,13.97 118.75,13.97 v118.75,50.8 | SW-A.6 144.78,72.39 144.78,54.61 v141.6,51.44
  Bottom 0.15: DN5.3 102.87,13.97 v112.39,13.97 | v141.6,51.44 140.97,50.8 v118.75,50.8
IN2_2  (via drill 0.35)
  Top 0.15: v111.12,16.51 112.39,17.78 112.39,42.55 115.57,45.72 115.57,53.34 119.38,57.15 119.38,66.04 121.92,68.58 121.92,72.39 SW-C.6
  Bottom 0.15: DN5.4 102.87,16.51 v111.12,16.51
IN2_3  (via drill 0.35)
  Top 0.15: DN5.5 99.69,19.68 v99.69,24.13 | v89.53,44.45 v89.53,26.67 | v77.47,44.45 v77.47,49.53
  Bottom 0.15: v99.69,24.13 97.16,26.67 v89.53,26.67 | v77.47,44.45 v89.53,44.45 | SW-F.6 66.04,59.69 67.94,59.69 68.58,59.05 68.58,49.53 v77.47,49.53
IN2_5  (via drill 0.35)
  Top 0.15: v88.9,35.56 v88.9,29.21 | v54.61,36.2 54.61,48.26 v52.07,50.8
  Bottom 0.15: DN5.7 100.33,24.13 100.33,24.77 99.69,24.77 95.89,28.57 95.25,28.57 94.61,29.21 v88.9,29.21 | v88.9,35.56 83.82,35.56 83.82,36.2 v54.61,36.2 | v52.07,50.8 52.07,55.67 48.05,59.69 43.18,59.69 SW-H.6
IN2_6  (via drill 0.35)
  Top 0.15: v99.06,40.01 v99.06,27.94
  Bottom 0.15: v99.06,27.94 DN5.8 | PWR.2 12.7,49.53 23.5,49.53 26.67,46.35 37.47,46.35 41.91,41.91 44.45,41.91 46.35,40.01 v99.06,40.01
IN2_7  (via drill 0.35)
  Top 0.15: DN5.9 100.97,28.57 v100.97,49.53
  Bottom 0.15: v100.97,49.53 135.89,49.53 PB.6
IN3  (via drill 0.35)
  Top 0.15: DN12.1 85.72,9.53 v85.72,16.51
  Bottom 0.15: DN7.1 DN12.1 | IC1.16 41.27,27.3 43.18,25.4 51.44,25.4 55.24,21.59 56.52,21.59 57.78,20.32 57.78,17.78 | RN1.5 57.78,17.78 | 57.78,17.78 59.05,16.51 v85.72,16.51
IN3_1  (via drill 0.35)
  Top 0.15: DN7.3 95.89,10.79 v95.89,9.53
  Bottom 0.15: v95.89,9.53 99.69,5.71 138.43,5.71 141.6,8.89 155.57,8.89 159.38,12.7 159.38,66.04 153.03,72.39 149.86,72.39 SW-A.8
IN3_2  (via drill 0.35)
  Top 0.15: v91.44,15.88 90.81,16.51 v90.81,42.55 | SW-C.8 124.46,72.39 124.46,68.58 121.92,66.04 121.92,53.34 122.56,52.7 122.56,43.18 v121.92,42.55
  Bottom 0.15: DN7.4 93.34,15.88 v91.44,15.88 | v121.92,42.55 v90.81,42.55
IN3_3  (via drill 0.35)
  Top 0.15: DN7.5 95.89,19.68 v95.89,40.64 | v76.2,40.64 v76.2,50.16
  Bottom 0.15: v76.2,40.64 v95.89,40.64 | SW-F.8 68.58,59.69 70.48,59.69 72.39,57.78 72.39,50.16 v76.2,50.16
IN3_5  (via drill 0.35)
  Top 0.15: v76.83,38.1 v76.83,30.48 | v50.16,38.1 46.99,41.27 46.99,56.52 45.72,57.78 45.72,59.69 SW-H.8
  Bottom 0.15: DN7.7 93.34,23.5 88.9,23.5 88.27,24.13 87,24.13 80.64,30.48 v76.83,30.48 | v50.16,38.1 v76.83,38.1
IN3_6
  Bottom 0.15: DN7.8 93.34,26.04 88.9,26.04 88.27,26.67 85.09,26.67 80.64,31.11 73.66,31.11 71.75,33.02 24.13,33.02 22.86,34.29 14.5,34.29 12.7,36.09 12.7,46.99 PWR.4
IN3_7  (via drill 0.35)
  Top 0.15: DN7.9 95.25,29.21 v95.25,34.92
  Bottom 0.15: v95.25,34.92 97.16,36.83 142.88,36.83 151.13,45.09 151.13,49.53 140.97,49.53 PB.8
IN4  (via drill 0.35)
  Top 0.15: v40.01,28.57 v40.01,22.23 40.01,8.26 v41.91,6.35
  Bottom 0.15: v40.01,28.57 IC1.17 | v40.01,22.23 53.98,22.23 RN1.6 | DN2.1 80.01,6.35 v41.91,6.35
IN4_0  (via drill 0.35)
  Top 0.15: DN2.2 79.38,12.06 v79.38,48.9
  Bottom 0.15: v79.38,48.9 70.48,48.9 68.58,46.99 RATE.3
IN4_1  (via drill 0.35)
  Top 0.15: v91.44,44.45 v91.44,17.14 | v93.34,44.45 93.34,46.99 CHKCTL.5
  Bottom 0.15: DN2.3 82.55,13.97 88.27,13.97 v91.44,17.14 | v93.34,44.45 v91.44,44.45
IN4_2  (via drill 0.35)
  Top 0.15: v120.65,38.1 123.19,40.64 123.19,58.12 126.03,60.96 SW-B.2 | v83.82,15.24 83.82,25.4 84.45,26.04 v84.45,36.2
  Bottom 0.15: v84.45,36.2 92.08,36.2 93.98,38.1 v120.65,38.1 | DN2.4 v83.82,15.24
IN4_3  (via drill 0.35)
  Top 0.15: v84.45,18.41 84.45,24.77 85.09,25.4 85.09,38.1 81.92,41.27 v81.92,52.7
  Bottom 0.15: DN2.5 81.92,18.41 v84.45,18.41 | SW-D.2 104.14,60.96 95.89,52.7 v81.92,52.7
IN4_4  (via drill 0.35)
  Top 0.15: v78.74,52.07 v78.74,22.86
  Bottom 0.15: v78.74,22.86 DN2.6 | v78.74,52.07 80.01,53.34 95.25,53.34 95.89,53.98 95.89,63.5 92.71,66.67 SW_E.17
IN4_5  (via drill 0.35)
  Top 0.15: v60.33,52.07 61.59,50.8 v61.59,31.75 | v53.34,52.07 53.34,68.58 52.07,69.85 43.81,69.85 43.18,70.48 43.18,72.39 SW-G.2
  Bottom 0.15: DN2.7 80.01,24.13 74.3,24.13 66.67,31.75 v61.59,31.75 | v53.34,52.07 v60.33,52.07
IN4_6  (via drill 0.35)
  Top 0.15: DN2.8 83.19,27.3 v83.19,35.56 | v57.15,35.56 57.15,70.48 v51.44,76.2
  Bottom 0.15: v57.15,35.56 v83.19,35.56 | v51.44,76.2 19.05,76.2 SW-J.2
IN4_7  (via drill 0.35)
  Top 0.15: DN2.9 82.55,29.21 v82.55,30.48 | v142.24,32.38 140.97,33.66 140.97,46.99 PB.10
  Bottom 0.15: v82.55,30.48 84.45,32.38 v142.24,32.38
IN5
  Top 0.15: DN4.1 73.03,7.62 71.12,5.71 57.78,5.71 57.78,20.95 RN1.7
  Bottom 0.15: RN1.7 49.53,29.21 35.56,29.21 34.92,29.84 IC1.18
IN5_0
  Top 0.15: DN4.2 71.12,6.35 64.14,6.35 64.14,7.62 62.87,8.89 60.33,8.89 60.33,17.78 61.59,19.05 64.14,19.05 64.14,46.99 RATE.1
IN5_1
  Top 0.15: DN4.3 79.06,8.57 79.06,7.04 79.94,6.16 89,6.16 90.49,7.65 90.49,11.75 87.95,14.29 86.36,14.29 86.36,14.61 86.07,14.9 86.07,15.58 86.68,16.19 89.85,16.19 89.85,14.92 90.17,14.61 92.08,14.61 92.08,46.35 91.44,46.99 CHKCTL.4
IN5_2  (via drill 0.35)
  Top 0.15: v118.75,5.08 120.02,6.35 120.02,12.7 120.65,13.34 120.65,14.61 120.02,15.24 120.02,34.92 123.83,38.73 123.83,52.07 v125.09,53.34
  Bottom 0.15: DN4.4 78.74,11.43 81.92,11.43 88.27,5.08 v118.75,5.08 | SW-B.4 129.54,59.69 127.64,59.69 125.09,57.15 v125.09,53.34
IN5_3  (via drill 0.35)
  Top 0.15: v78.11,52.7 v78.11,17.78 | v107.95,62.87 SW-D.4 | v88.27,63.5 v93.34,68.58
  Bottom 0.15: v78.11,17.78 DN4.5 | v107.95,62.87 102.23,68.58 v93.34,68.58 | v88.27,63.5 88.27,62.23 88.9,61.59 88.9,57.78 87.63,56.52 81.92,56.52 v78.11,52.7
IN5_4  (via drill 0.35)
  Top 0.15: v77.47,38.73 v77.47,20.32 | SW_E.19 95.25,65.41 91.44,61.59 91.44,56.52 90.17,55.24 v90.17,38.73
  Bottom 0.15: v77.47,20.32 DN4.6 | v77.47,38.73 v90.17,38.73
IN5_5  (via drill 0.35)
  Top 0.15: DN4.7 73.03,24.77 73.03,45.09 74.93,46.99 74.93,53.34 76.2,54.61 v76.2,66.67
  Bottom 0.15: SW-G.4 45.72,72.39 45.72,66.67 v76.2,66.67
IN5_6  (via drill 0.35)
  Top 0.15: v62.23,32.38 62.23,53.98 58.42,57.78 v58.42,74.3
  Bottom 0.15: DN4.8 67.94,32.38 v62.23,32.38 | v58.42,74.3 57.15,75.56 20.95,75.56 SW-J.4
IN5_7  (via drill 0.35)
  Top 0.15: v74.93,33.02 DN4.9 | v145.41,50.8 144.78,50.16 PB.12
  Bottom 0.15: v74.93,33.02 144.15,33.02 156.21,45.09 156.21,49 154.41,50.8 v145.41,50.8
IN6  (via drill 0.35)
  Top 0.15: v59.69,21.59 v59.69,11.43
  Bottom 0.15: IC1.19 42.55,31.11 43.18,30.48 50.8,30.48 RN1.8 v59.69,21.59 | DN6.1 64.77,11.43 v59.69,11.43
IN6_0  (via drill 0.35)
  Top 0.15: DN6.2 66.04,12.7 v66.04,42.55 | v111.12,43.18 113.67,45.72 113.67,46.99 ROSCTL.3
  Bottom 0.15: v111.12,43.18 85.09,43.18 84.45,42.55 v66.04,42.55
IN6_1  (via drill 0.35)
  Top 0.15: v64.77,41.91 v64.77,15.88 | v86.36,42.55 86.36,46.99 CHKCTL.2
  Bottom 0.15: DN6.3 65.41,15.88 v64.77,15.88 | v64.77,41.91 84.45,41.91 85.09,42.55 v86.36,42.55
IN6_2  (via drill 0.35)
  Top 0.15: v72.39,15.88 72.39,45.09 74.3,46.99 v74.3,50.8
  Bottom 0.15: DN6.4 69.22,15.88 v72.39,15.88 | v74.3,50.8 74.93,51.44 95.89,51.44 97.16,52.7 v127,52.7 127.64,53.34 128.49,53.34 132.08,56.93 132.08,59.69 SW-B.6
IN6_3  (via drill 0.35)
  Top 0.15: DN6.5 66.67,19.68 66.67,20.32 67.94,21.59 70.48,21.59 70.48,45.09 69.85,45.72 69.85,50.8 v73.03,53.98 | SW-D.6 110.49,66.67 v107.95,69.22 | v88.27,76.83 86.36,74.93 86.36,70.48 83.19,67.31 v83.19,64.14
  Bottom 0.15: v107.95,69.22 101.6,75.56 100.33,75.56 99.06,76.83 v88.27,76.83 | v73.03,53.98 v83.19,64.14
IN6_4  (via drill 0.35)
  Top 0.15: v50.16,32.38 46.48,36.07 46.48,44.96 45.72,45.72 45.72,46.99 SPARE.2 46.35,46.99
  Bottom 0.15: DN6.6 64.77,24.13 61.59,24.13 53.34,32.38 v50.16,32.38
IN6_5  (via drill 0.35)
  Top 0.15: v57.78,29.84 55.24,32.38 v55.24,67.94
  Bottom 0.15: DN6.7 64.14,27.3 64.14,28.95 63.24,29.84 v57.78,29.84 | SW-G.6 48.26,72.39 48.26,67.31 54.61,67.31 v55.24,67.94
IN6_6  (via drill 0.35)
  Top 0.15: v57.78,31.11 55.88,33.02 v55.88,66.04
  Bottom 0.15: DN6.8 62.87,31.11 v57.78,31.11 | SW-J.6 22.86,72.39 27.3,72.39 33.66,66.04 v55.88,66.04
IN6_7  (via drill 0.35)
  Top 0.15: DN6.9 69.85,29.21 v69.85,34.29 | v153.67,45.09 153.67,48.9 153.03,49.53 148.59,49.53 PB.14
  Bottom 0.15: v69.85,34.29 142.88,34.29 v153.67,45.09
IN7
  Top 0.15: DN8.1 58.42,7.62 58.42,25.4 RN1.9
  Bottom 0.15: IC1.20 42.55,32.38 43.18,31.75 52.07,31.75 RN1.9
IN7_0  (via drill 0.35)
  Top 0.15: DN8.2 66.67,10.16 67.94,8.89 71.75,8.89 v71.75,43.18 | v107.31,43.81 109.22,45.72 ROSCTL.1
  Bottom 0.15: v71.75,43.18 72.39,43.81 v107.31,43.81
IN7_1  (via drill 0.35)
  Top 0.15: DN8.3 65.41,12.7 v65.41,43.18
  Bottom 0.15: v65.41,43.18 66.67,44.45 76.2,44.45 78.74,46.99 CHKCTL.1
IN7_2  (via drill 0.35)
  Top 0.15: v155.57,31.11 152.4,27.94 v152.4,6.35 | v85.72,5.08 v88.9,1.91 | v68.58,13.97 66.67,13.97 v66.67,13.34
  Bottom 0.15: v52.7,19.05 55.24,16.51 56.52,16.51 57.15,15.88 61.59,15.88 DN8.4 64.77,15.24 v66.67,13.34 | SW-B.8 137.16,59.69 137.16,57.46 142.55,52.07 153.67,52.07 156.84,48.9 156.84,32.38 v155.57,31.11 | v152.4,6.35 147.96,1.91 v88.9,1.91 | v85.72,5.08 81.92,8.89 80.64,8.89 75.56,13.97 v68.58,13.97
IN7_3  (via drill 0.35)
  Top 0.15: v69.22,19.05 71.12,20.95 71.12,44.45 73.66,46.99 73.66,51.44 74.3,52.07 v74.3,57.78
  Bottom 0.15: DN8.5 63.5,19.05 v69.22,19.05 | SW-D.8 99.06,74.93 84.45,74.93 83.82,74.3 83.82,73.03 83.19,72.39 81.92,72.39 81.28,71.75 81.28,69.11 79.48,67.31 78.11,67.31 74.93,64.14 74.93,58.42 v74.3,57.78
IN7_4  (via drill 0.35)
  Top 0.15: DN8.6 59.69,22.86 v59.69,45.72
  Bottom 0.15: v59.69,45.72 58.42,46.99 SPARE.4
IN7_5  (via drill 0.35)
  Top 0.15: 60.33,24.77 DN8.7 | v59.05,25.4 59.05,31.11 56.52,33.66 56.52,68.58 52.7,72.39 49.53,72.39 SW-G.8
  Bottom 0.15: DN8.7 59.69,25.4 v59.05,25.4
IN7_6  (via drill 0.35)
  Top 0.15: v59.05,32.38 57.78,33.66 57.78,71.12 v56.52,72.39
  Bottom 0.15: DN8.8 58.42,29.21 57.15,29.21 56.52,29.84 56.52,32.38 v59.05,32.38 | v56.52,72.39 53.98,74.93 25.4,74.93 SW-J.8
IN7_7  (via drill 0.35)
  Top 0.15: DN8.9 63.5,29.21 v63.5,34.92
  Bottom 0.15: v63.5,34.92 92.71,34.92 95.25,37.47 140.97,37.47 148.59,45.09 148.59,48.26 PB.16
LAMP_LOAD  (via drill 0.35)
  Top 0.15: v36.83,44.48 37.47,43.81 v37.47,26.67
  Bottom 0.15: v36.83,44.48 36.83,45.09 Q5.1 | v37.47,26.67 39.37,24.77 IC1.11
LAMP_MAN  (via drill 0.35)
  Top 0.15: v41.91,28.57 41.91,48.9 v39.37,51.44
  Bottom 0.15: IC1.8 v41.91,28.57 | v39.37,51.44 38.1,51.44 36.83,52.7 Q2.1
LAMP_SYS  (via drill 0.35)
  Top 0.15: v30.48,32.38 29.21,33.66 v29.21,50.16
  Bottom 0.15: v30.48,32.38 32.38,30.48 42.55,30.48 43.18,29.84 IC1.7 | 29.84,52.7 Q1.1 30,52.7 29.84,52.7 | 29.84,52.7 29.21,52.07 v29.21,50.16
LAMP_TEST  (via drill 0.35)
  Top 0.15: v45.72,41.43 46.04,41.12 46.04,33.5 46.99,32.54 v46.99,28.1
  Bottom 0.15: v45.72,41.43 43.02,44.13 40.16,44.13 38.1,46.2 38.1,47.62 Q4.1 36.67,49.05 | v46.99,28.1 44.93,26.04 IC1.10
LAMP_WAIT  (via drill 0.35)
  Top 0.15: v32.38,28.57 v32.38,48.26
  Bottom 0.15: v32.38,48.26 31.11,48.26 30.48,48.9 Q3.1 | v32.38,28.57 33.02,27.94 43.18,27.94 43.81,27.3 IC1.9
N$1
  Bottom 0.15: LAMPS.1 2.54,54.61 R2.2
N$2
  Bottom 0.15: LAMPS.3 8.89,57.15 6.35,54.61 R3.2
N$3
  Bottom 0.15: R4.2 10.16,58.42 LAMPS.5
N$4
  Bottom 0.15: LAMPS.7 R5.2
N$5
  Bottom 0.15: R6.2 17.78,58.42 LAMPS.9
N$7  (via drill 0.35)
  Top 0.15: v31.11,45.72 31.75,46.35 v31.75,48.9
  Bottom 0.15: v31.11,45.72 33.02,45.72 34.29,44.45 Q5.3 | v31.75,48.9 31.75,53.71 30.85,54.61 29.84,54.61 24.77,59.69 17.78,59.69 LAMPS.10
N$8
  Bottom 0.15: Q4.3 34.92,48.26 33.02,50.16 33.02,53.98 24.77,62.23 15.24,62.23 LAMPS.8
N$9  (1 unrouted)
  Bottom 0.15: 27.94,48.26 22.86,53.34 16.51,53.34 15.24,54.61 15.24,59.69 12.7,59.69 LAMPS.6
N$10
  Bottom 0.15: LAMPS.4 10.79,62.87 27.19,62.87 34.29,55.77 34.29,52.07 Q2.3
N$11  (via drill 0.35)
  Top 0.15: v18.41,55.88 17.14,57.15 7.62,57.15 7.62,59.69 LAMPS.2
  Bottom 0.15: v18.41,55.88 24.13,55.88 27.94,52.07 Q1.3
PWRLED
  Bottom 0.15: PWR.9 21.46,45.72 | R1.1 17.91,42.04
  Bottom 0.61: 17.91,42.04 PWR.9
PWROFF  (via drill 0.35)
  Top 0.15: v26.67,32.38 24.77,34.29 24.77,36.2 K1.1
  Bottom 0.15: v26.67,32.38 D1.C | 23.91,36.83 24.13,36.83 K1.1 24.77,36.97 24.77,45.09 22.86,46.99 20.32,46.99 PWR.8
SCAN_0  (via drill 0.35)
  Top 0.15: v43.18,21.59 42.55,22.23 v42.55,33.66
  Bottom 0.15: v43.18,21.59 42.55,21.59 42.55,19.68 IC2.1 | IC1.4 v42.55,33.66
SCAN_1  (via drill 0.35)
  Top 0.15: v45.09,19.05 46.35,20.32 v46.35,32.38
  Bottom 0.15: v45.09,19.05 43.18,19.05 42.55,18.41 IC2.2 | IC1.5 v46.35,32.38
SCAN_2  (via drill 0.35)
  Top 0.15: v36.2,22.23 v36.2,31.75
  Bottom 0.15: v36.2,22.23 36.83,22.23 41.91,17.14 IC2.3 | IC1.6 43.18,31.11 42.55,31.75 v36.2,31.75
SCL  (via drill 0.35)
  Top 0.15: v36.2,34.92 34.92,33.66 34.92,5.71 34.29,5.08 X1.3
  Bottom 0.15: v36.2,34.92 IC1.22
SDA  (via drill 0.35)
  Top 0.15: v36.83,35.56 36.83,5.71 37.47,5.08 X1.4
  Bottom 0.15: v36.83,35.56 35.56,35.56 34.92,36.2 IC1.23
SEL_B_C  (via drill 0.35)
  Top 0.15: SW-B.7 SW-B.9 | SW-B.5 SW-B.3 | v38.1,16.51 38.73,17.14 v38.73,37.47 | v80.01,52.07 v80.01,39.37 | v116.2,57.15 118.11,59.05 SW-C.3
  Bottom 0.15: SW-B.3 SW-B.1 | SW-B.7 134.62,58.42 | 134.62,58.42 SW-B.5 | v38.1,16.51 37.47,16.51 36.83,15.88 IC2.13 | v38.73,37.47 40.01,38.73 76.2,38.73 76.83,39.37 v80.01,39.37 | v80.01,52.07 95.89,52.07 100.97,57.15 v116.2,57.15 | SW-C.1 SW-C.3 SW-C.5 SW-C.7 SW-C.9 134.62,62.23 134.62,58.42
SEL_CHECK_CTL_A  (via drill 0.35)
  Top 0.15: v53.98,40.64 v53.98,16.51 | v93.98,41.27 95.89,43.18 95.89,46.99 CHKCTL.6 96.52,46.99 96.52,50.8 v97.16,51.44 | SW-A.1 140.97,59.05 v136.53,54.61
  Bottom 0.15: IC2.14 40.64,17.14 41.27,16.51 v53.98,16.51 | v53.98,40.64 54.61,41.27 v93.98,41.27 | v97.16,51.44 133.35,51.44 v136.53,54.61 | SW-A.1 SW-A.3 SW-A.5 SW-A.7 SW-A.9
SEL_D_F  (via drill 0.35)
  Top 0.15: v52.7,15.88 53.34,16.51 53.34,37.47 52.7,38.1 v52.7,48.9 | SW-F.3 SW-F.1 | SW-F.7 SW-F.9
  Bottom 0.15: v52.7,15.88 44.45,15.88 43.81,15.24 37.47,15.24 36.83,14.61 IC2.12 | SW-F.3 SW-F.5 SW-F.7 | SW-F.1 53.98,52.7 52.7,52.7 v52.7,48.9
SEL_D_PWR_EI
  Bottom 0.15: SW-D.1 SW-D.3 SW-D.5 SW-D.7 SW-D.9
SEL_EO_PWR_EI  (via drill 0.35)
  Top 0.15: v45.09,13.97 44.45,14.61 44.45,46.35 43.81,46.99 SPARE.1 | v95.25,78.11 SW_E.20 | v51.44,67.94 48.9,65.41 48.9,48.9 48.26,48.26 48.26,46.99 SPARE.3
  Bottom 0.15: v45.09,13.97 37.47,13.97 36.83,13.34 IC2.11 | SPARE.1 43.81,46.99 43.81,48.9 46.35,48.9 48.26,46.99 SPARE.3 | v95.25,78.11 85.72,78.11 85.09,77.47 78.74,77.47 76.2,74.93 60.33,74.93 53.34,67.94 v51.44,67.94
SEL_G_H  (via drill 0.35)
  Top 0.15: SW-G.3 SW-G.5 SW-G.7 | v34.29,12.7 34.29,34.29 35.56,35.56 35.56,55.88 36.83,57.15 SW-H.1 | SW-G.1 43.18,69.85 43.18,59.69 SW-H.5
  Bottom 0.15: v34.29,12.7 35.56,12.7 36.2,12.06 IC2.10 | SW-G.9 SW-G.7 | SW-G.3 SW-G.1 | SW-H.1 SW-H.3 SW-H.5 SW-H.7 SW-H.9
SEL_J_SW_1  (via drill 0.35)
  Top 0.15: PWR.1 PWR.3 15.24,46.99 19.68,46.99 20.32,47.62 20.32,69.85 SW-J.5 | PB.17 151.76,45.09 v151.76,6.99
  Bottom 0.15: PB.19 PB.17 | PWR.1 11.43,35.95 13.72,33.66 22.23,33.66 27.3,28.57 29.58,28.57 30.48,27.68 30.48,15.02 34.07,11.43 35.56,11.43 36.2,10.79 IC2.9 38.1,10.79 40.64,8.26 40.64,5.71 43.18,3.17 147.96,3.17 v151.76,6.99 | SW-J.1 SW-J.3 SW-J.5 SW-J.7 SW-J.9
SEL_ROS_RATE_ADDR_COMP  (via drill 0.35)
  Top 0.15: v38.1,19.68 38.1,45.72 v38.73,46.35 | 71.12,46.99 RATE.4 | ADRCOMP.10 93.98,59.69 v93.98,49.53
  Bottom 0.15: v38.1,19.68 36.83,18.41 IC2.15 | v38.73,46.35 40.01,45.09 69.22,45.09 71.12,46.99 | 93.98,48.9 81.28,48.9 80.01,47.62 71.75,47.62 71.12,46.99 | 93.98,48.9 116.2,48.9 116.2,46.99 ROSCTL.4 | 71.12,46.99 RATE.4 | v93.98,49.53 93.98,48.9
SEL_SW_2_3  (via drill 0.35)
  Top 0.15: PB.15 PB.13 | v52.07,37.47 v52.07,12.06 | PB.3 PB.5 PB.7
  Bottom 0.15: v52.07,12.06 IC2.7 | v52.07,37.47 90.81,37.47 92.71,39.37 128.27,39.37 133.35,44.45 | PB.3 133.35,44.45 | 133.35,44.45 PB.1 | PB.7 PB.9 PB.11 PB.13

### Text on the board
tNames: Switch Interface 1.0
bNames: Switch Interface 1.0